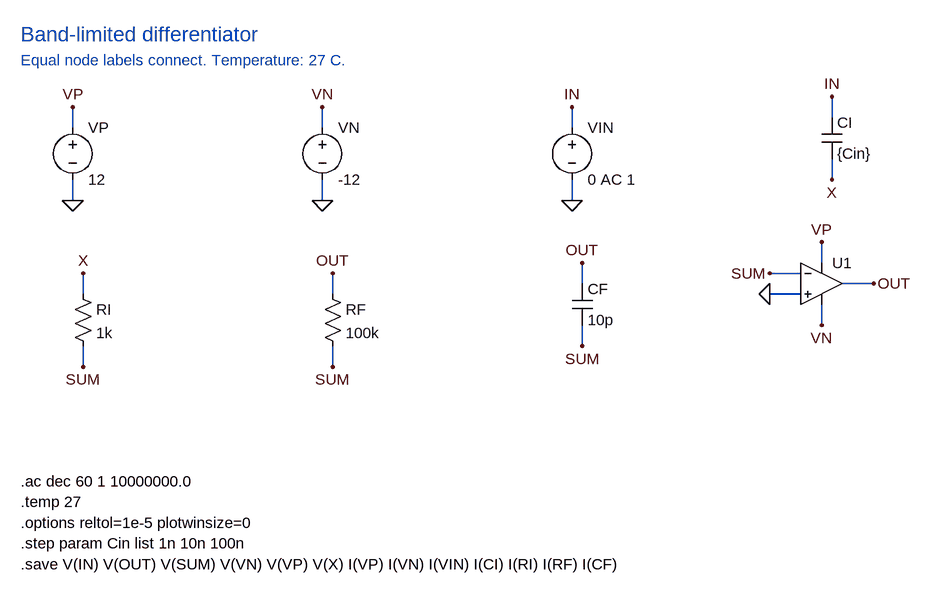
[diagram p0: schematic opamp-differentiator.asc]
opamp-differentiator.asc, the LTspice schematic file:
Version 4
SHEET 1 1740 1000
WIRE 144 176 144 144
WIRE 144 256 144 288
WIRE 528 176 528 144
WIRE 528 256 528 288
WIRE 912 176 912 144
WIRE 912 256 912 288
WIRE 1312 160 1312 128
WIRE 1312 224 1312 256
WIRE 160 432 160 400
WIRE 160 512 160 544
WIRE 544 432 544 400
WIRE 544 512 544 544
WIRE 928 416 928 384
WIRE 928 480 928 512
WIRE 1264 432 1216 432
WIRE 1264 400 1216 400
WIRE 1296 384 1296 352
WIRE 1296 448 1296 480
WIRE 1328 416 1376 416
FLAG 144 144 VP
FLAG 144 288 0
FLAG 528 144 VN
FLAG 528 288 0
FLAG 912 144 IN
FLAG 912 288 0
FLAG 1312 128 IN
FLAG 1312 256 X
FLAG 160 400 X
FLAG 160 544 SUM
FLAG 544 400 OUT
FLAG 544 544 SUM
FLAG 928 384 OUT
FLAG 928 512 SUM
FLAG 1216 432 0
FLAG 1216 400 SUM
FLAG 1296 352 VP
FLAG 1296 480 VN
FLAG 1376 416 OUT
SYMBOL voltage 144 160 R0
SYMATTR InstName VP
SYMATTR Value 12
SYMBOL voltage 528 160 R0
SYMATTR InstName VN
SYMATTR Value -12
SYMBOL voltage 912 160 R0
SYMATTR InstName VIN
SYMATTR Value 0 AC 1
SYMBOL cap 1296 160 R0
SYMATTR InstName CI
SYMATTR Value {Cin}
SYMBOL res 144 416 R0
SYMATTR InstName RI
SYMATTR Value 1k
SYMBOL res 528 416 R0
SYMATTR InstName RF
SYMATTR Value 100k
SYMBOL cap 912 416 R0
SYMATTR InstName CF
SYMATTR Value 10p
SYMBOL OpAmps/UniversalOpamp2 1296 416 R0
SYMATTR InstName U1
SYMATTR SpiceModel level2
SYMATTR Value2 Avol=1Meg GBW=10Meg Slew=10Meg
SYMATTR SpiceLine Ilimit=100m Rail=0.5 Vos=0
SYMATTR SpiceLine2 En=0 Enk=0 In=0 Ink=0 Rin=1G
TEXT 64 32 Left 3 ;Band-limited differentiator
TEXT 64 72 Left 2 ;Equal node labels connect. Temperature: 27 C.
TEXT 64 720 Left 2 !.ac dec 60 1 10000000.0
TEXT 64 752 Left 2 !.temp 27
TEXT 64 784 Left 2 !.options reltol=1e-5 plotwinsize=0
TEXT 64 816 Left 2 !.step param Cin list 1n 10n 100n
TEXT 64 848 Left 2 !.save V(IN) V(OUT) V(SUM) V(VN) V(VP) V(X) I(VP) I(VN) I(VIN) I(CI) I(RI) I(RF) I(CF)

The netlist it stands for:
* opamp-differentiator.asc
VP VP 0 12
VN VN 0 -12
VIN IN 0 0 AC 1
CI IN X {Cin}
RI X SUM 1k
RF OUT SUM 100k
CF OUT SUM 10p
XU1 0 SUM VP VN OUT level2 Avol=1Meg GBW=10Meg Slew=10Meg Ilimit=100m Rail=0.5 Vos=0 En=0 Enk=0 In=0 Ink=0 Rin=1G  ; pins In+ In- V+ V- OUT
* Band-limited differentiator
* Equal node labels connect. Temperature: 27 C.
.ac dec 60 1 10000000.0
.temp 27
.options reltol=1e-5 plotwinsize=0
.step param Cin list 1n 10n 100n
.save V(IN) V(OUT) V(SUM) V(VN) V(VP) V(X) I(VP) I(VN) I(VIN) I(CI) I(RI) I(RF) I(CF)
.lib UniversalOpAmp2.lib
.backanno
.end